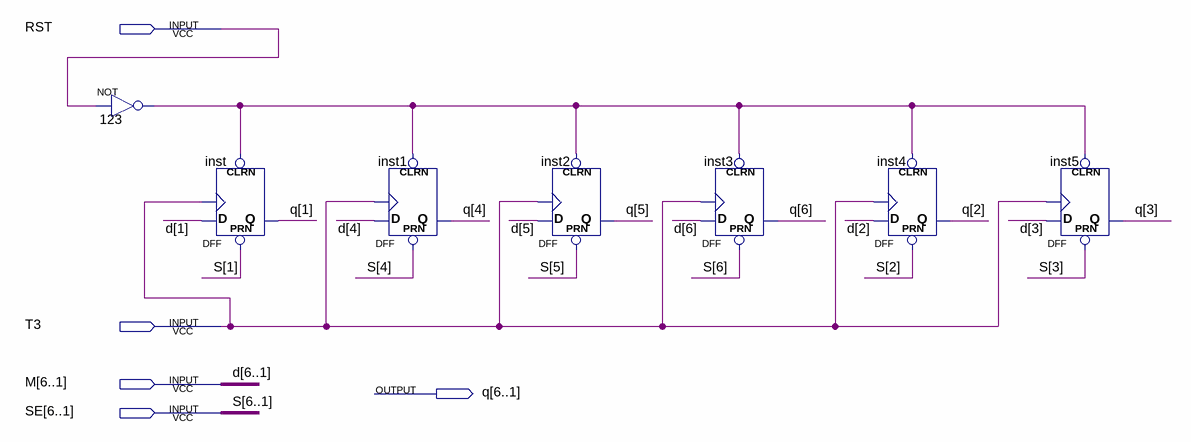
[diagram p0: schematic sheet]
// Quartus schematic uA_reg.bdf as structural Verilog: 7 symbols, 5 pins
module uA_reg (
  input  RST,
  input  T3,
  input  [6:1] M,
  input  [6:1] SE,
  output [6:1] q
);

  wire n123_out;

  not u_123 (n123_out, RST);
  DFF inst (.CLRN(n123_out), .CLK(T3), .D(M[1]), .PRN(SE[1]), .Q(q[1]));
  DFF inst1 (.CLRN(n123_out), .CLK(T3), .D(M[4]), .PRN(SE[4]), .Q(q[4]));
  DFF inst2 (.CLRN(n123_out), .CLK(T3), .D(M[5]), .PRN(SE[5]), .Q(q[5]));
  DFF inst3 (.CLRN(n123_out), .CLK(T3), .D(M[6]), .PRN(SE[6]), .Q(q[6]));
  DFF inst4 (.CLRN(n123_out), .CLK(T3), .D(M[2]), .PRN(SE[2]), .Q(q[2]));
  DFF inst5 (.CLRN(n123_out), .CLK(T3), .D(M[3]), .PRN(SE[3]), .Q(q[3]));

  // Other names for the same wires on the sheet: d[6:1] = M; S[6:1] = SE
endmodule
